# Altium schematic sheet 3V3_board.SchDoc
size A4
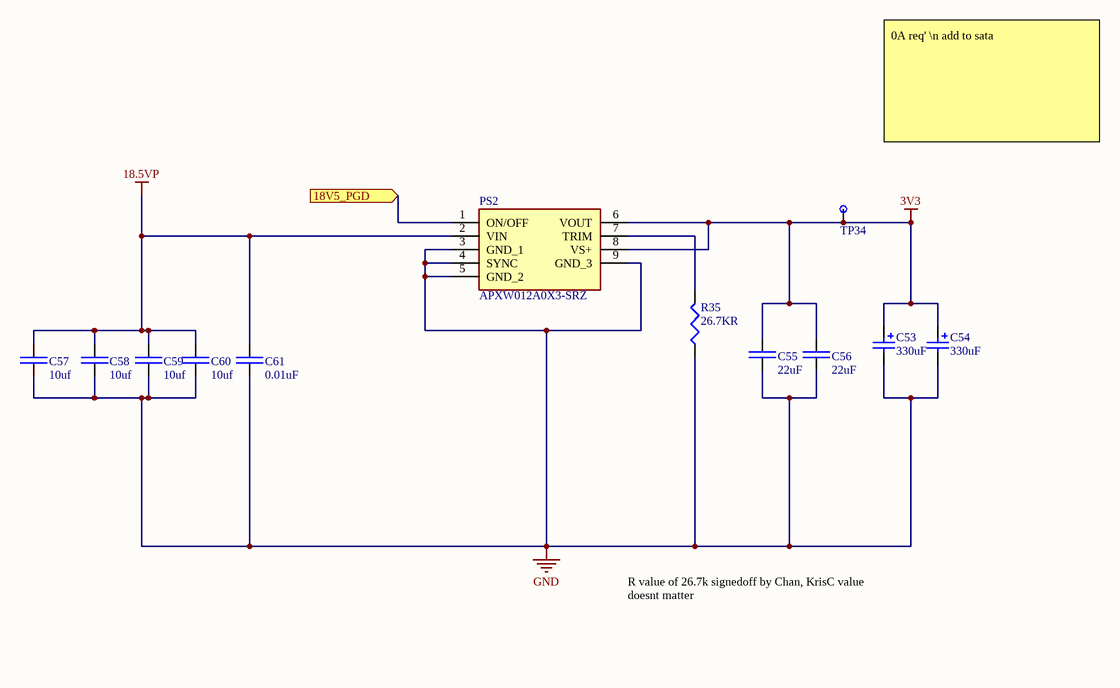
[diagram p0: 3V3_board.SchDoc]

## Parts
C53  330uF  [330uF throught hole]
C54  330uF  [330uF throught hole]
C55  22uF  [22uF Capacitor]
C56  22uF  [22uF Capacitor]
C57  10uf  [10uF capacitor LPB]
C58  10uf  [10uF capacitor LPB]
C59  10uf  [10uF capacitor LPB]
C60  10uf  [10uF capacitor LPB]
C61  0.01uF  [0.01uF capacitor]
PS2  APXW012A0X3-SRZ  [APXW012A0X3SRZ]
R35  26.7KR  [26.7KR Resistor]
TP34  TestPt  [50_MIL_PAD]  (value not drawn)

## Ports
18V5_PGD (in)

## Nets
3V3: C53.1 C54.1 C55.2 C56.2 PS2.6(VOUT) PS2.8(VS+) TP34.1
18.5VP: C57.2 C58.2 C59.2 C60.2 C61.2 PS2.2(VIN)
GND: C53.2 C54.2 C55.1 C56.1 C57.1 C58.1 C59.1 C60.1 C61.1 PS2.3(GND_1) PS2.4(SYNC) PS2.5(GND_2) PS2.9(GND_3) R35.1
18V5_PGD: PS2.1(ON/OFF) ; port 18V5_PGD
NetPS2_7: PS2.7(TRIM) R35.2

## Notes on the sheet
- 0A req' \n add to sata
- R value of 26.7k signedoff by Chan, KrisC value doesnt matter

## Library data of the parts
C53 C54 = 35ZLH330MEFCT810X12.5: CAP ALUM 330UF 20% 35V RADIAL; Manufacturer 1: Rubycon; Ripple Current: 731.5mA; Impedance: 39mR; Life (Hours): 10000Hour; Supplier 1: Digi-Key; Supplier Part Number 1: 1189-3752-1-ND; Manufacturer Part Number 1: 35ZLH330MEFCT810X12.5; Stock 1: 14330; Pricing 1: 1=0,52000, 10=0,36900, 100=0,24280 (USD); RoHS: Yes; Mount: Through Hole; Case/Package: Radial; Min Operating Temperature: -40°C; Max Operating Temperature: 105°C; Package Quantity: 1000; Capacitance: 330uF; Packaging: Tape and Reel; Tolerance: 20%; Voltage Rating: 35V; Lead Pitch: 0.197inch; Height - Seated (Max): 0.551inch; ComponentLink1URL: http://www.rubycon.co.jp/en/catalog/e_pdfs/aluminum/e_ZLH.pdf?src-supplier=Digi-Key; ComponentLink1Description: http://www.rubycon.co.jp/en/catalog/e_pdfs/aluminum/e_ZLH.pdf?src-supplier=Digi-Key; ComponentLink2URL: http://www.rubycon.co.jp/en/catalog/e_pdfs/aluminum/Radial_Lead_Alumi_Eng.pdf?src-supplier=Digi-Key; ComponentLink2Description: http://www.rubycon.co.jp/en/catalog/e_pdfs/aluminum/Radial_Lead_Alumi_Eng.pdf?src-supplier=Digi-Key
C55 C56 = GRM32ER71E226KE15L: Cap Ceramic 22uF 25V X7R 10% SMD 1210 125C Embossed T/R; Manufacturer 1: Murata; Supplier 1: Digi-Key; Supplier Part Number 1: 490-5313-6-ND; Manufacturer Part Number 1: GRM32ER71E226KE15L; Stock 1: 52660; Pricing 1: 1=1,78000, 10=1,40600, 100=1,05410, 500=0,79646 (USD); RoHS: Yes; Mount: Surface Mount; Case/Package: 1210; Number of Pins: 2; Case Code (Metric): 3225; Case Code (Imperial): 1210; Material: Ceramic; Min Operating Temperature: -55°C; Max Operating Temperature: 125°C; Capacitance: 22uF; Tolerance: 10%; Dielectric: X7R; Voltage Rating: 25V; Packaging: Tape and Reel; Package Quantity: 1; Voltage Rating (DC): 25V; Termination: SMD/SMT; Voltage: 25V; Length: 3.2mm; Height: 2.5mm; Width: 0.098inch; Thickness: 0.106inch; Depth: 2.5mm; Radiation Hardening: No; REACH SVHC: No SVHC; Lead Free: Lead Free; ComponentLink1URL: https://datasheet.ciiva.com/6072/1697714-6072768.pdf?src-supplier=Farnell; ComponentLink1Description: https://datasheet.ciiva.com/6072/1697714-6072768.pdf?src-supplier=Farnell; ComponentLink2URL: https://datasheet.ciiva.com/16497/product-16497009.pdf?src-supplier=Future+Electronics; ComponentLink2Description: https://datasheet.ciiva.com/16497/product-16497009.pdf?src-supplier=Future+Electronics; ComponentLink3URL: https://datasheet.ciiva.com/3776/2741grm32er71e226ke1523-3776996.pdf?src-supplier=Arrow; ComponentLink3Description: https://datasheet.ciiva.com/3776/2741grm32er71e226ke1523-3776996.pdf?src-supplier=Arrow; ComponentLink4URL: https://datasheet.ciiva.com/11789/0900766b80ef921d-11789129.pdf?src-supplier=RSComponents; ComponentLink4Description: https://datasheet.ciiva.com/11789/0900766b80ef921d-11789129.pdf?src-supplier=RSComponents; ComponentLink5URL: https://datasheet.ciiva.com/29201/451826-da-01-de-vs-kondens-grm32-er71e-226ke15l-29201795.pdf?src-supplier=Conrad; ComponentLink5Description: https://datasheet.ciiva.com/29201/451826-da-01-de-vs-kondens-grm32-er71e-226ke15l-29201795.pdf?src-supplier=Conrad; ComponentLink6URL: https://datasheet.ciiva.com/175/partnumbering-e-01-175746.pdf?src-supplier=Digi-Key; ComponentLink6Description: https://datasheet.ciiva.com/175/partnumbering-e-01-175746.pdf?src-supplier=Digi-Key; ComponentLink7URL: https://datasheet.ciiva.com/175/partnumbering-e-01-175747.pdf?src-supplier=Digi-Key; ComponentLink7Description: https://datasheet.ciiva.com/175/partnumbering-e-01-175747.pdf?src-supplier=Digi-Key; ComponentLink8URL: https://datasheet.ciiva.com/175/partnumbering-e-01-175748.pdf?src-supplier=Digi-Key; ComponentLink8Description: https://datasheet.ciiva.com/175/partnumbering-e-01-175748.pdf?src-supplier=Digi-Key; ComponentLink9URL: https://datasheet.ciiva.com/22703/1697714-22703397.pdf?src-supplier=Element14; ComponentLink9Description: https://datasheet.ciiva.com/22703/1697714-22703397.pdf?src-supplier=Element14; Category: Capacitor
C57-C60 = GRT31CR61H106ME01L: CAP CER 10UF 50V X5R 1206; Manufacturer 1: Murata; Tolerance: 20%; Supplier 1: Digi-Key; Supplier Part Number 1: 490-12457-1-ND; Manufacturer Part Number 1: GRT31CR61H106ME01L; Stock 1: 8159; Pricing 1: 1=0,50000, 10=0,34900, 100=0,20920, 500=0,15690, 1000=0,13249 (USD); RoHS: Yes; Mount: Surface Mount; Case/Package: 1206; Case Code (Metric): 3216; Case Code (Imperial): 1206; Min Operating Temperature: -55°C; Max Operating Temperature: 85°C; Packaging: Tape and Reel; Capacitance: 10uF; Voltage Rating: 50V; Length: 0.126inch; Width: 0.063inch; Thickness: 0.071inch; Ratings: AEC-Q200; ComponentLink1URL: http://search.murata.co.jp/Ceramy/image/img/A01X/G101/ENG/GRT31CR61H106ME01-01.pdf?src-supplier=Digi-Key; ComponentLink1Description: http://search.murata.co.jp/Ceramy/image/img/A01X/G101/ENG/GRT31CR61H106ME01-01.pdf?src-supplier=Digi-Key; Category: Capacitor
C61 = C0603C103KARACAUTO: Cap Ceramic 0.01uF 250V X7R 10% Pad SMD 0603 125C Automotive T/R; Manufacturer 1: KEMET; Capacitance: 10nF; Supplier 1: Digi-Key; Supplier Part Number 1: 399-17960-1-ND; Manufacturer Part Number 1: C0603C103KARACAUTO; Stock 1: 8483; Pricing 1: 1=0,90000, 10=0,68500, 100=0,49040, 500=0,37964, 1000=0,32691 (USD); RoHS: No; Mount: Surface Mount; Case/Package: 0603; Case Code (Imperial): 0603; Case Code (Metric): 1608; Min Operating Temperature: -55°C; Max Operating Temperature: 125°C; Packaging: Tape and Reel; Tolerance: 10%; Voltage Rating: 250V; Ratings: AEC-Q200; ComponentLink1URL: https://api.kemet.com/component-edge/download/datasheet/C0603C103KARACAUTO.pdf?src-supplier=Digi-Key; ComponentLink1Description: https://api.kemet.com/component-edge/download/datasheet/C0603C103KARACAUTO.pdf?src-supplier=Digi-Key; Category: Capacitor
PS2 = APXW012A0X3-SRZ: Power Supply; Manufacturer_Name: ABB; Datasheet Link: https://datasheet.datasheetarchive.com/originals/distributors/Datasheets_SAMA/683ccf345f63793608341fe806dd9fff.pdf; Height: 10mm; Manufacturer_Part_Number: APXW012A0X3-SRZ; Mouser Part Number: 894-APXW012A0X3-SRZ; Mouser Price/Stock: https://www.mouser.co.uk/ProductDetail/ABB/APXW012A0X3-SRZ?qs=R2DZpqZpp70Xpp2aKRKJXQ%3D%3D
R35 = ERA-3AEB2672V: RES SMD 26.7KOHM 0.1% 1/10W 0603; Manufacturer 1: Panasonic; Power Rating: 100mW; Voltage Rating: 75V; Temperature Coefficient: 25ppm/°C; Supplier 1: Digi-Key; Supplier Part Number 1: P26.7KDBCT-ND; Manufacturer Part Number 1: ERA-3AEB2672V; Stock 1: 17260; Pricing 1: 1=0,35000, 10=0,30000, 100=0,11720, 1000=0,04906, 2500=0,04498 (USD); RoHS: Yes; Mount: Surface Mount; Case/Package: 0603; Number of Pins: 2; Case Code (Metric): 1608; Case Code (Imperial): 0603; Contact Plating: Tin; Min Operating Temperature: -55°C; Max Operating Temperature: 155°C; Resistance: 26.7kR; Tolerance: 0.1%; Packaging: Tape and Reel; Package Quantity: 1; Composition: Thin Film,Metal Film; Number of Terminations: 2; Max Power Dissipation: 100mW; Voltage Rating (DC): 75V; Features: Automotive AEC-Q200; Length: 1.6mm; Height: 0.45mm; Width: 0.8mm; Depth: 0.8mm; Radiation Hardening: No; Lead Free: Lead Free; REACH SVHC: No SVHC; ComponentLink1URL: https://datasheet.ciiva.com/11814/0900766b80eb1d8c-11814836.pdf?src-supplier=RSComponents; ComponentLink1Description: https://datasheet.ciiva.com/11814/0900766b80eb1d8c-11814836.pdf?src-supplier=RSComponents; ComponentLink2URL: https://datasheet.ciiva.com/5987/485442-5987192.pdf?src-supplier=Farnell; ComponentLink2Description: https://datasheet.ciiva.com/5987/485442-5987192.pdf?src-supplier=Farnell; ComponentLink3URL: https://datasheet.ciiva.com/5987/485442-5987183.pdf?src-supplier=Farnell; ComponentLink3Description: https://datasheet.ciiva.com/5987/485442-5987183.pdf?src-supplier=Farnell; ComponentLink4URL: https://datasheet.ciiva.com/46422/485442-46422629.pdf?src-supplier=Element14; ComponentLink4Description: https://datasheet.ciiva.com/46422/485442-46422629.pdf?src-supplier=Element14; ComponentLink5URL: https://datasheet.ciiva.com/17210/aoa0000ce26-17210681.pdf?src-supplier=Avnet+Europe; ComponentLink5Description: https://datasheet.ciiva.com/17210/aoa0000ce26-17210681.pdf?src-supplier=Avnet+Europe